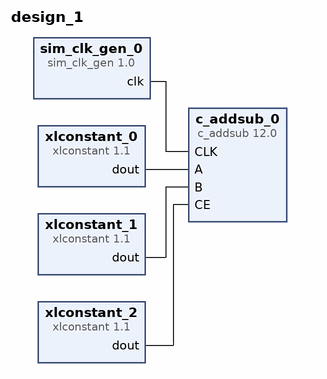
[diagram p0: block diagram of the top level]
# Vivado block design design_1, xc7z007sclg400-1, Vivado 2023.1
create_bd_design design_1

create_bd_cell -type ip -vlnv xilinx.com:ip:c_addsub:12.0 c_addsub_0
create_bd_cell -type ip -vlnv xilinx.com:ip:xlconstant:1.1 xlconstant_0
set_property -dict {CONFIG.CONST_VAL 4 CONFIG.CONST_WIDTH 15} [get_bd_cells xlconstant_0]
create_bd_cell -type ip -vlnv xilinx.com:ip:xlconstant:1.1 xlconstant_1
set_property -dict {CONFIG.CONST_VAL 5 CONFIG.CONST_WIDTH 15} [get_bd_cells xlconstant_1]
create_bd_cell -type ip -vlnv xilinx.com:ip:sim_clk_gen:1.0 sim_clk_gen_0
create_bd_cell -type ip -vlnv xilinx.com:ip:xlconstant:1.1 xlconstant_2

# ---- connections ----

connect_bd_net [get_bd_pins sim_clk_gen_0/clk] [get_bd_pins c_addsub_0/CLK]
connect_bd_net [get_bd_pins xlconstant_0/dout] [get_bd_pins c_addsub_0/A]
connect_bd_net [get_bd_pins xlconstant_1/dout] [get_bd_pins c_addsub_0/B]
connect_bd_net [get_bd_pins xlconstant_2/dout] [get_bd_pins c_addsub_0/CE]

validate_bd_design
save_bd_design
